# Altium schematic sheet Bike_Light_PCB_2017_Front_LED_Driver.SchDoc
size A
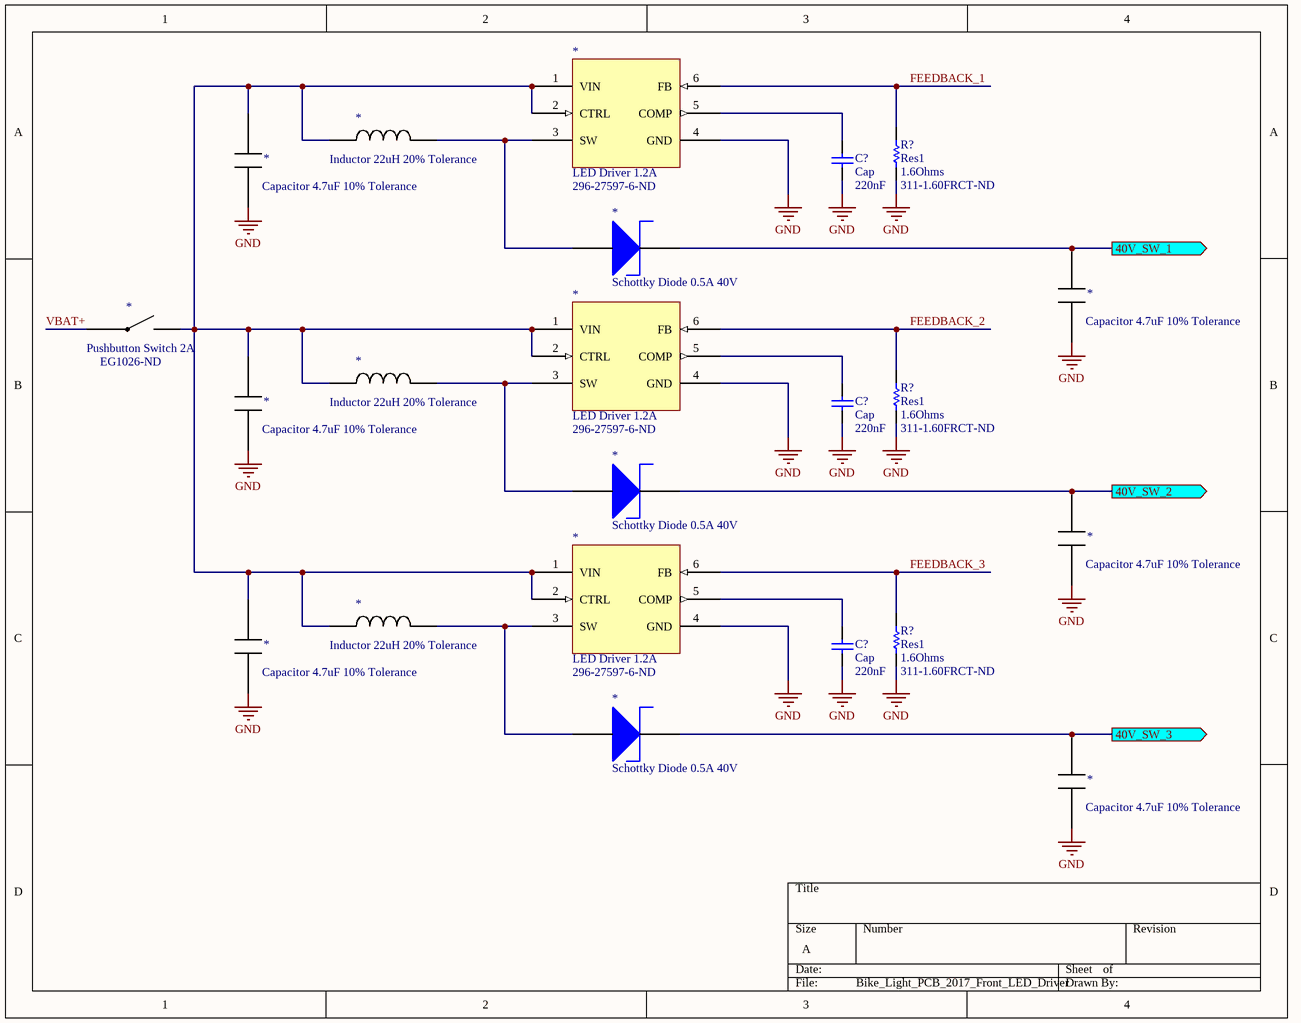
[diagram p0: Bike_Light_PCB_2017_Front_LED_Driver.SchDoc]

## Parts
(Parts that share a designator on the sheet are numbered #1, #2 ... from top to bottom, then left to right.)
*#1  Inductor 22uH 20% Tolerance
*#2  Capacitor 4.7uF 10% Tolerance
*#3  LED Driver 1.2A  Supplier Part Number 1: 296-27597-6-ND
*#4  Schottky Diode 0.5A 40V
*#5  Capacitor 4.7uF 10% Tolerance
*#6  Pushbutton Switch 2A  Supplier Part Number 1: EG1026-ND
*#7  Inductor 22uH 20% Tolerance
*#8  Capacitor 4.7uF 10% Tolerance
*#9  LED Driver 1.2A  Supplier Part Number 1: 296-27597-6-ND
*#10  Schottky Diode 0.5A 40V
*#11  Capacitor 4.7uF 10% Tolerance
*#12  Inductor 22uH 20% Tolerance
*#13  Capacitor 4.7uF 10% Tolerance
*#14  LED Driver 1.2A  Supplier Part Number 1: 296-27597-6-ND
*#15  Schottky Diode 0.5A 40V
*#16  Capacitor 4.7uF 10% Tolerance
C?#1  Cap  value 220nF  [RAD-0.3]
C?#2  Cap  value 220nF  [RAD-0.3]
C?#3  Cap  value 220nF  [RAD-0.3]
R?#1  Res1  value 1.6Ohms  Supplier Part Number 1: 311-1.60FRCT-ND  [AXIAL-0.3]
R?#2  Res1  value 1.6Ohms  Supplier Part Number 1: 311-1.60FRCT-ND  [AXIAL-0.3]
R?#3  Res1  value 1.6Ohms  Supplier Part Number 1: 311-1.60FRCT-ND  [AXIAL-0.3]

## Ports
40V_SW_1 (out), 40V_SW_2 (out), 40V_SW_3 (out)

## Nets
GND: *#2.0 *#3.4(GND) *#5.0 *#8.0 *#9.4(GND) *#11.0 *#13.0 *#14.4(GND) *#16.0 C?#1.1 C?#2.1 C?#3.1 R?#1.1 R?#2.1 R?#3.1
40V_SW_1: *#4.3 *#5.1 ; port 40V_SW_1
40V_SW_2: *#10.3 *#11.1 ; port 40V_SW_2
40V_SW_3: *#15.3 *#16.1 ; port 40V_SW_3
FEEDBACK_1: *#3.6(FB) R?#1.2
FEEDBACK_2: *#9.6(FB) R?#2.2
FEEDBACK_3: *#14.6(FB) R?#3.2
VBAT+: *#6.10
Net*#1_28: *#1.28 *#2.1 *#3.1(VIN) *#3.2(CTRL) *#6.11 *#7.28 *#8.1 *#9.1(VIN) *#9.2(CTRL) *#12.28 *#13.1 *#14.1(VIN) *#14.2(CTRL)
Net*#1_29: *#1.29 *#3.3(SW) *#4.2
Net*#3_5: *#3.5(COMP) C?#1.2
Net*#7_29: *#7.29 *#9.3(SW) *#10.2
Net*#9_5: *#9.5(COMP) C?#2.2
Net*#12_29: *#12.29 *#14.3(SW) *#15.2
Net*#14_5: *#14.5(COMP) C?#3.2

## Library data of the parts
C?#1-C?#3 = Cap: Capacitor; Published: 8-Jun-2000; LatestRevisionDate: 17-Jul-2002; LatestRevisionNote: Re-released for DXP Platform.; PackageReference: RAD-0.3; Publisher: Altium Limited; PackageDescription: Radial Cap, Thru-Hole; 2 Leads; 0.3 in Pin Spacing; Supplier 1: Digi-Key; Supplier Part Number 1: 399-14760-1-ND
R?#1-R?#3 = Res1: Resistor; Published: 8-Jun-2000; LatestRevisionDate: 17-Jul-2002; LatestRevisionNote: Re-released for DXP Platform.; PackageReference: AXIAL-0.3; Publisher: Altium Limited; PackageDescription: Axial Device, Thru-Hole; 2 Leads; 0.3 in Pin Spacing; Supplier 1: Digi-Key
*#1 *#7 *#12 = Inductor 22uH 20% Tolerance: Supplier 1: Digi-Key; Supplier Part Number 1: 445-174218-1-ND
*#2 *#5 *#8 *#11 *#13 *#16 = Capacitor 4.7uF 10% Tolerance: Supplier 1: Digi-Key; Supplier Part Number 1: 587-5034-2-ND
*#3 *#9 *#14 = LED Driver 1.2A: Supplier 1: Digi-Key
*#4 *#10 *#15 = Schottky Diode 0.5A 40V: Supplier 1: Digi-Key; Supplier Part Number 1: MBR0540CT-ND
*#6 = Pushbutton Switch 2A: Supplier 1: Digi-Key